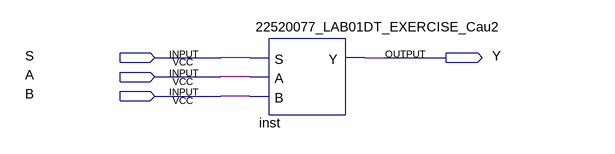
[diagram p0: schematic sheet]
// Quartus schematic LAB01DT_EXERCISE_blockdiagram2.bdf as structural Verilog: 1 symbols, 4 pins
module LAB01DT_EXERCISE_blockdiagram2 (
  input  S,
  input  A,
  input  B,
  output Y
);

  \22520077_LAB01DT_EXERCISE_Cau2  inst (.S(S), .A(A), .B(B), .Y(Y));
endmodule
